# EasyEDA Pro project 轮腿PCB.eprj, schematic Schematic2

## Sheets
1 核心板: Board Name: 主板; Create Date: 2026-02-27
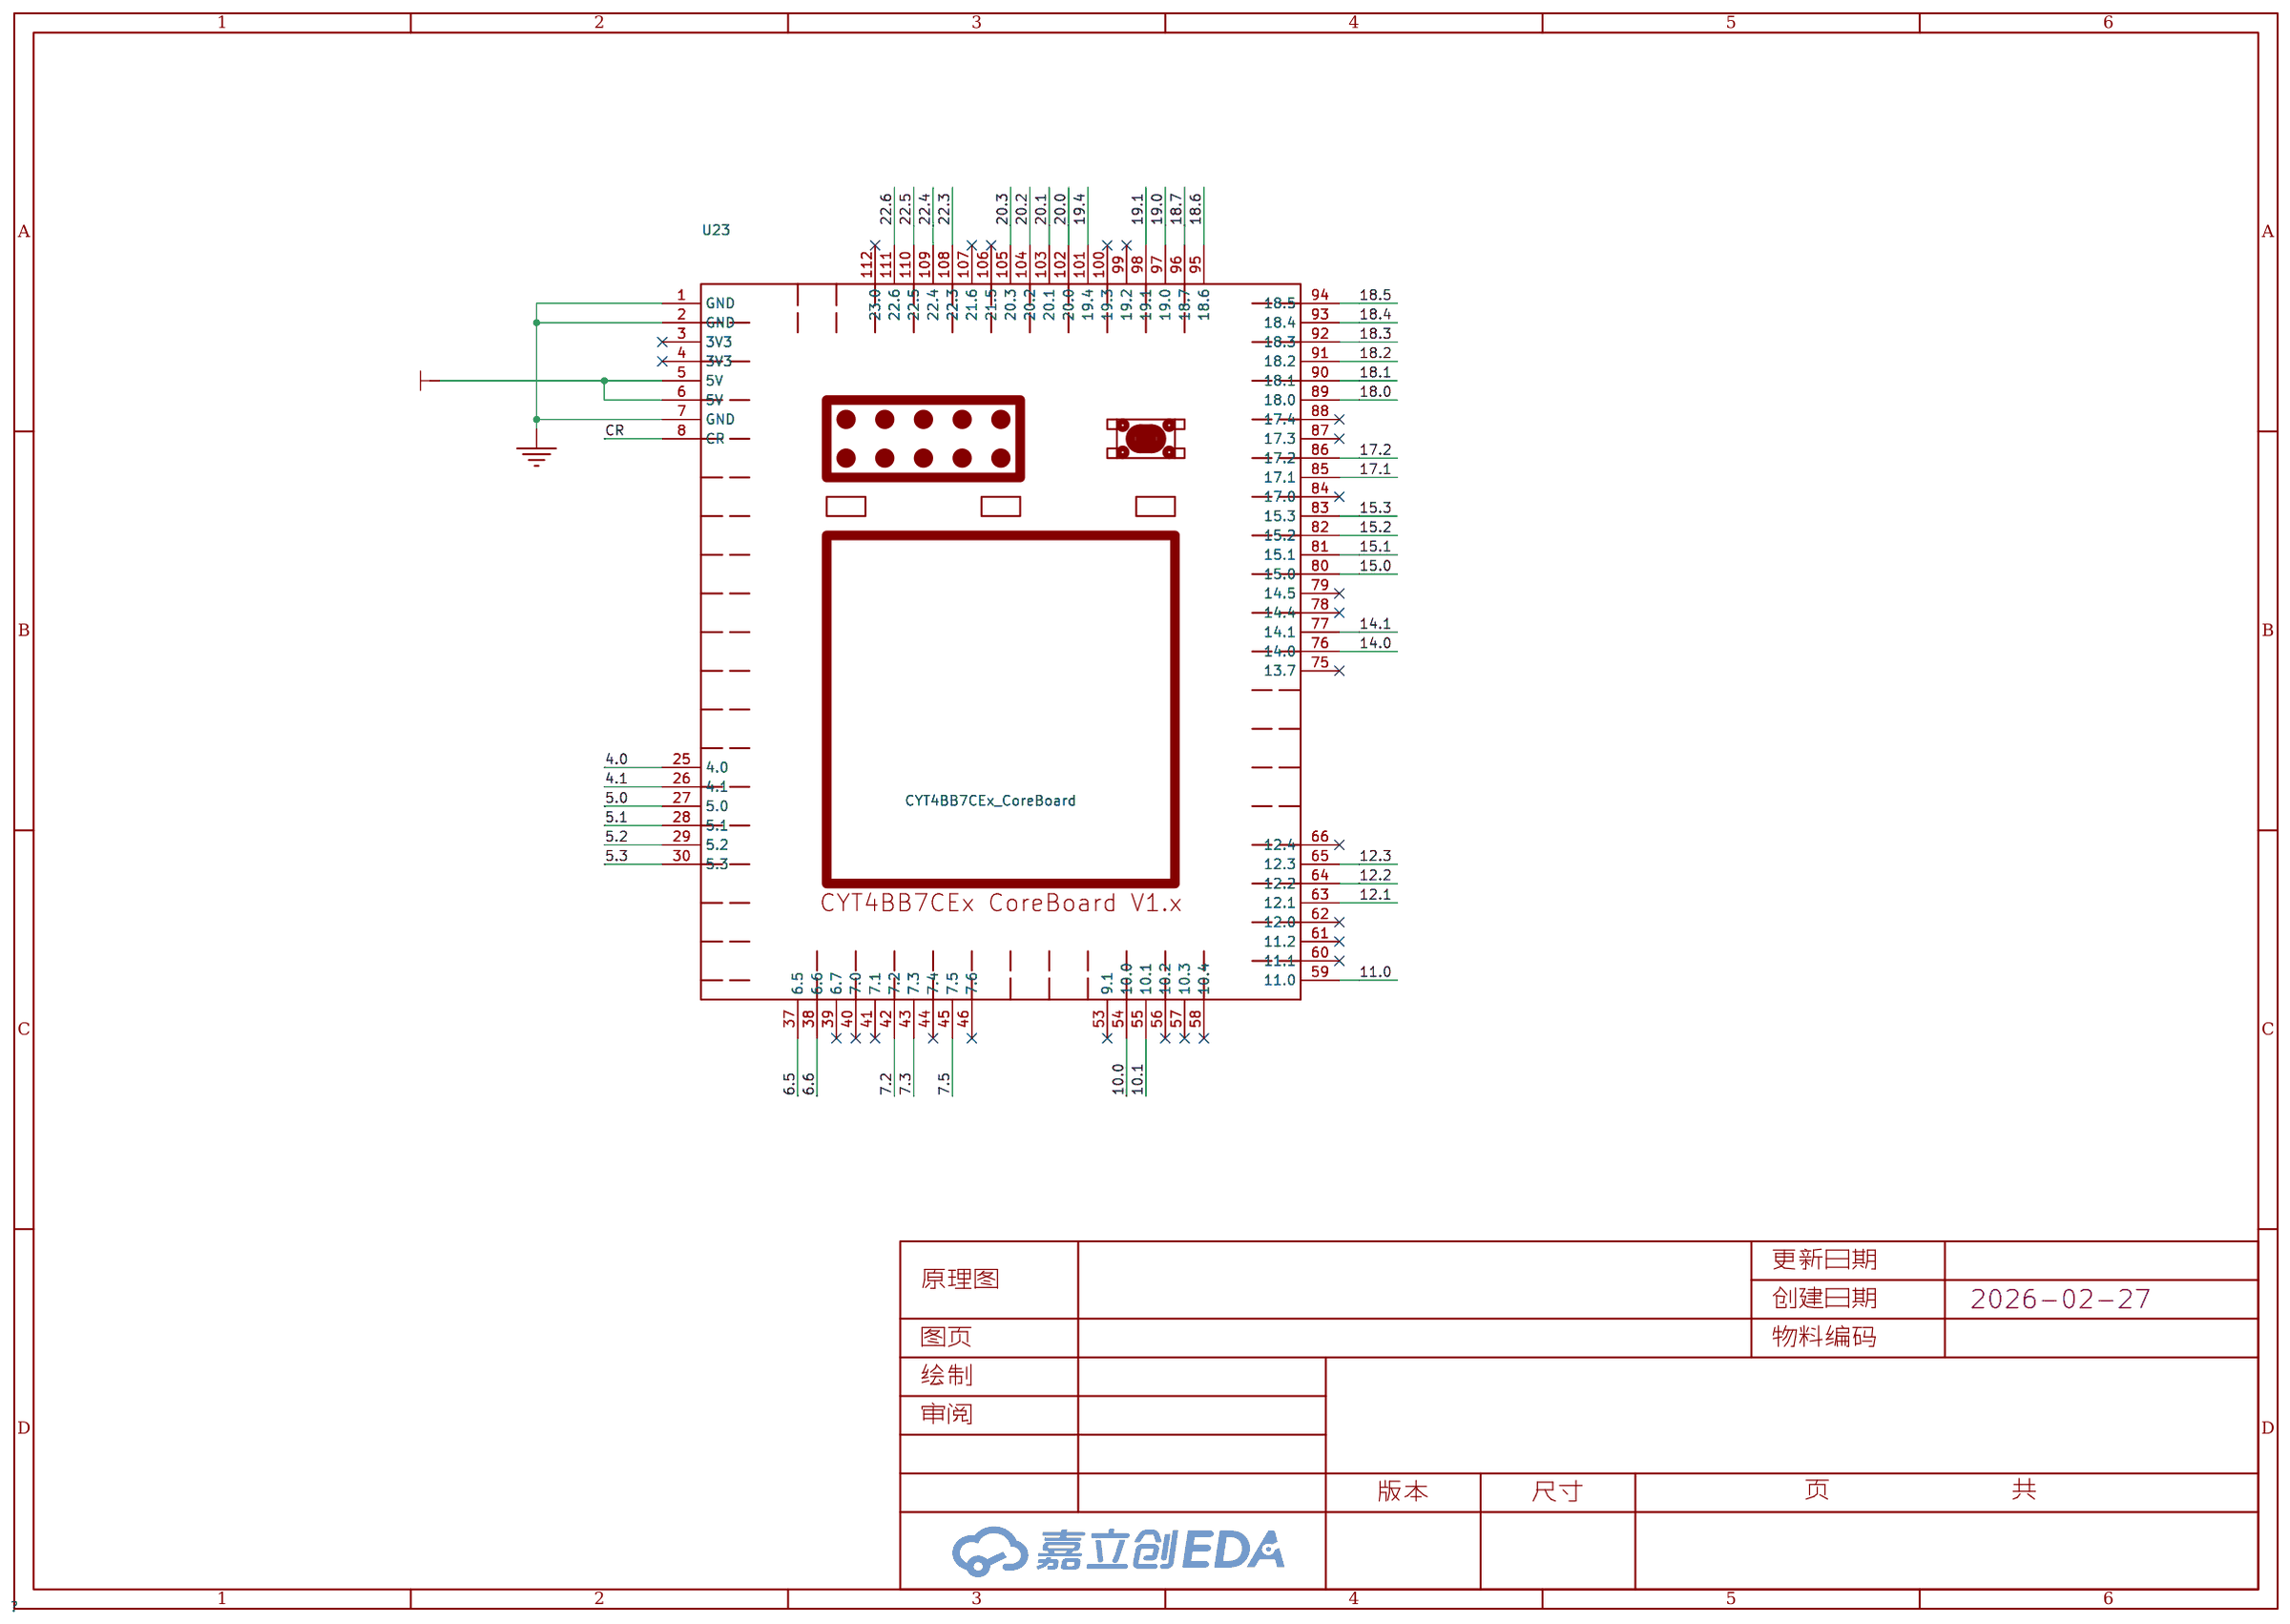
[diagram p1: 核心板]
2 主板: Create Date: 2026-02-28
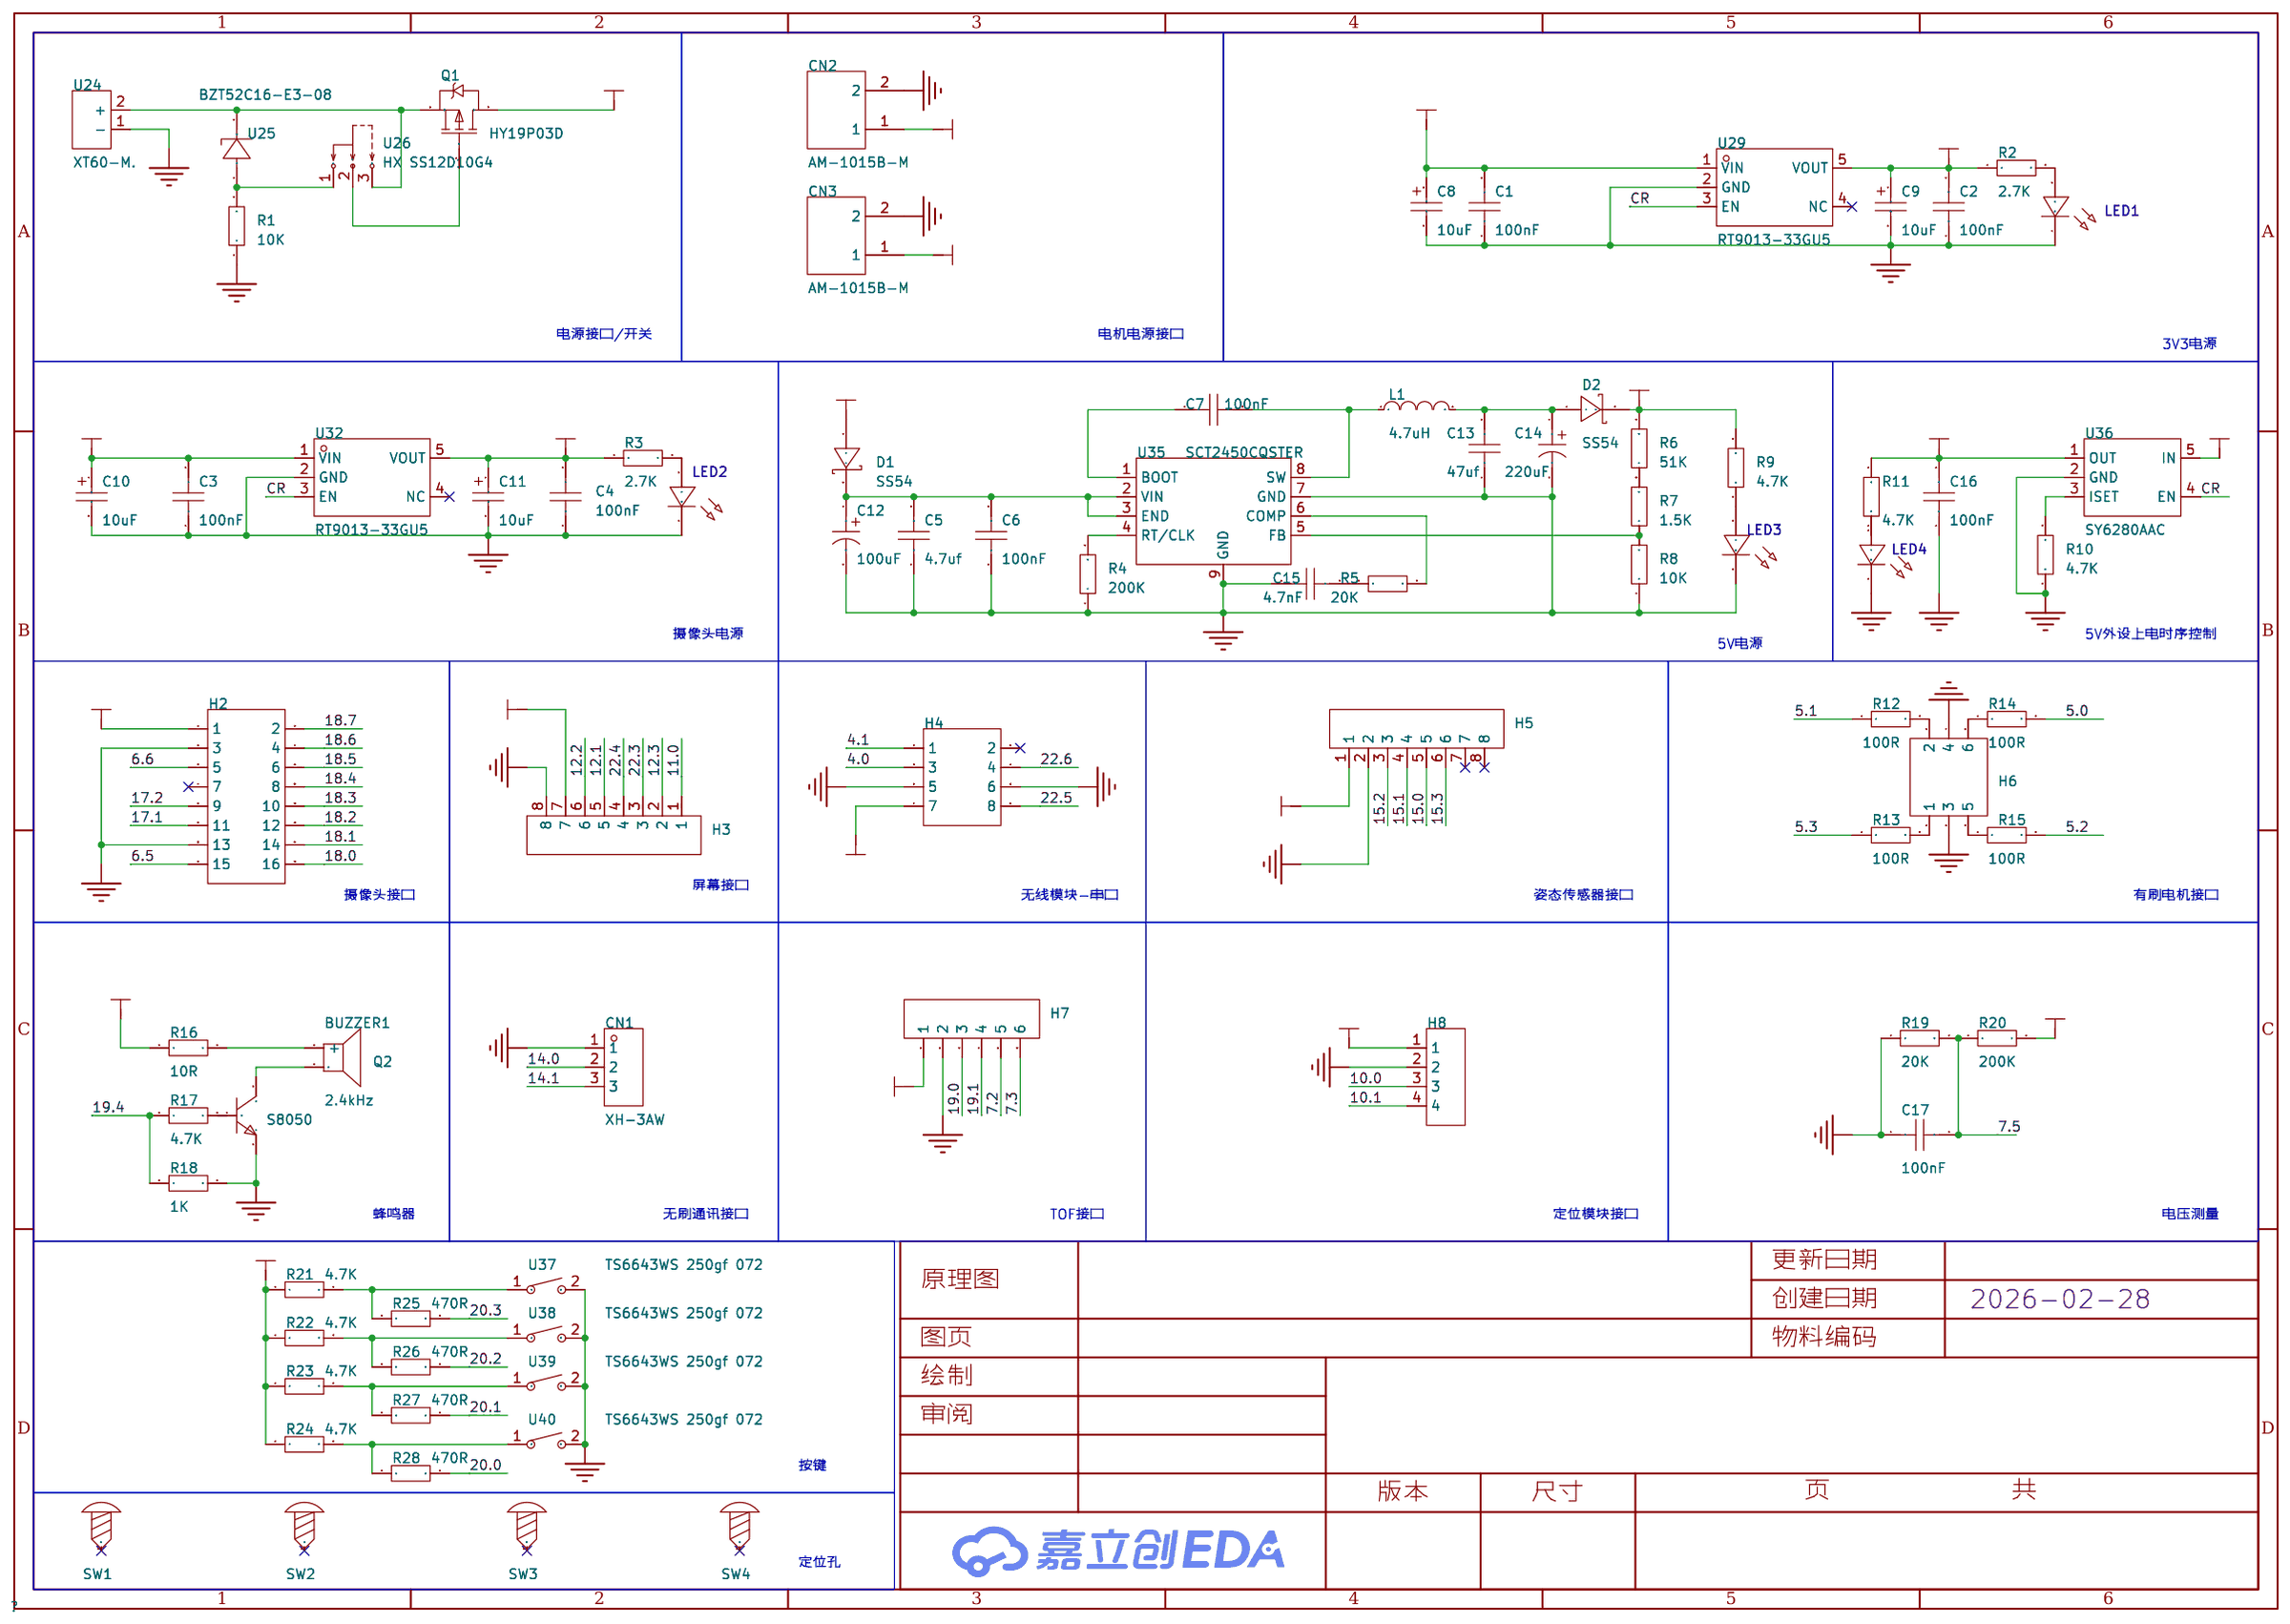
[diagram p2: 主板]

## Parts
sheet 主板
BUZZER1  2.4kHz  [BUZ-TH_BD12.0-P7.60-D0.6-FD]
C1  100nF  [C0603]
C2  100nF  [C0603]
C3  100nF  [C0603]
C4  100nF  [C0603]
C5  4.7uf  [C0603]
C6  100nF  [C0603]
C7  100nF  [C0603]
C8  10uF  [CAP-SMD_L3.2-W1.6-RD-C7171]
C9  10uF  [CAP-SMD_L3.2-W1.6-RD-C7171]
C10  10uF  [CAP-SMD_L3.2-W1.6-RD-C7171]
C11  10uF  [CAP-SMD_L3.2-W1.6-RD-C7171]
C12  100uF  [CAP-SMD_BD6.3-L6.6-W6.6-LS7.3-FD-H7.7]
C13  47uf  [C0603]
C14  220uF  [CAP-SMD_BD8.0-L8.3-W8.3-LS9.1-FD]
C15  4.7nF  [C0603]
C16  100nF  [C0603]
C17  100nF  [C0603]
CN1  XH-3AW  [CONN-TH_3P-P2.54_HCTL_XH-3AW]
CN2  AM-1015B-M  [CONN-TH_AM-1015B-M]
CN3  AM-1015B-M  [CONN-TH_AM-1015B-M]
D1  SS54  [SMA_L4.4-W2.8-LS5.4-R-RD]
D2  SS54  [SMA_L4.4-W2.8-LS5.4-R-RD]
H2  -  [HDR-TH_16P-P2.54-V-F-R2-C8-S2.54-1]
H3  -  [HDR-TH_8P-P2.54-V-F-1]
H4  -  [HDR-TH_8P-P2.54-V-F-R2-C4-S2.54-1]
H5  -  [HDR-TH_8P-P2.54-V-F-1]
H6  -  [HDR-TH_6P-P2.54-V-R2-C3-S2.54_A2541WV-2X3P]
H7  -  [HDR-TH_6P-P2.54-V-M-1]
H8  -  [HDR-TH_4P-P2.54-V-M]
L1  4.7uH  [IND-SMD_L5.4-W5.2_FXL0530]
LED1  -  [LED_0603]
LED2  -  [LED_0603]
LED3  -  [LED_0603]
LED4  -  [LED_0603]
Q1  HY19P03D  [TO-252-2_L6.6-W6.1-P4.57-LS9.9-TL-CW]
Q2  S8050  [SOT-23-3_L2.9-W1.3-P1.90-LS2.3-BR]
R1  10K  [R0603]
R2  2.7K  [R0603]
R3  2.7K  [R0603]
R4  200K  [R0603]
R5  20K  [R0603]
R6  51K  [R0603]
R7  1.5K  [R0603]
R8  10K  [R0603]
R9  4.7K  [R0603]
R10  4.7K  [R0603]
R11  4.7K  [R0603]
R12  100R  [R0603]
R13  100R  [R0603]
R14  100R  [R0603]
R15  100R  [R0603]
R16  10R  [R0603]
R17  4.7K  [R0603]
R18  1K  [R0603]
R19  20K  [R0603]
R20  200K  [R0603]
R21  4.7K  [R0603]
R22  4.7K  [R0603]
R23  4.7K  [R0603]
R24  4.7K  [R0603]
R25  470R  [R0603]
R26  470R  [R0603]
R27  470R  [R0603]
R28  470R  [R0603]
SW1  -  [M3螺丝]
SW2  -  [M3螺丝]
SW3  -  [M3螺丝]
SW4  -  [M3螺丝]
U24  XT60-M.  [CONN-TH_XT60]
U25  BZT52C16-E3-08  [SOD-123_L2.7-W1.6-LS3.7-R-RD]
U26  HX SS12D10G4  [SW-TH_SHOU-HAN_SS12D10G4]
U29  RT9013-33GU5  [SC-70-5_L2.0-W1.3-P0.65-LS2.1-BR]
U32  RT9013-33GU5  [SC-70-5_L2.0-W1.3-P0.65-LS2.1-BR]
U35  SCT2450CQSTER  [ESOP-8_L4.9-W3.9-P1.27-LS6.0-BL-EP]
U36  SY6280AAC  [SOT-23-5_L3.0-W1.7-P0.95-LS2.8-BL]
U37  TS6643WS 250gf 072  [SW-SMD_L6.0-W6.0-P6.00-LS6.8]
U38  TS6643WS 250gf 072  [SW-SMD_L6.0-W6.0-P6.00-LS6.8]
U39  TS6643WS 250gf 072  [SW-SMD_L6.0-W6.0-P6.00-LS6.8]
U40  TS6643WS 250gf 072  [SW-SMD_L6.0-W6.0-P6.00-LS6.8]
sheet 核心板
U23  CYT4BB7CEx_CoreBoard  [CYT4BB7CEx_CoreBoard_V1.x]

## Library data of the parts
BUZZER1 = TMB12A05_C96093: 驱动方式:有源(内含驱动线路);构造类型:电磁式;额定电压:5V;频率:2.4kHz;声压(SPL):85dB;; LCSC Part Name: 有源(内含驱动线路) 电磁式 2.4kHz; Supplier Part: C96093; Manufacturer: 华能; Manufacturer Part: TMB12A05; Supplier Footprint: 插件,D=12mm; Datasheet: https://item.szlcsc.com/datasheet/TMB12A05/97297.html; Supplier: LCSC; Driver Circuitry: 有源(内含驱动线路); Technology: 电磁式; Voltage Rating: 5V; Voltage - Supply: 4V~8V; Current Consumption: 30mA; Sound Pressure Level(SPL): 85dB; Diameter(φD): 12mm; Height: 9.8mm; Operating Temperature: -40℃~+85℃
C1-C6 C13 C15-C17 = CAP_0603: Supplier Footprint: 0603
C7 = CC0603KRX7R9BB104: 容值:100nF;精度:±10%;额定电压:50V;温度系数:X7R;; LCSC Part Name: 100nF ±10% 50V; Supplier Part: C14663; Manufacturer: YAGEO(国巨); Supplier Footprint: 0603; JLCPCB Part Class: 基础库; Datasheet: https://item.szlcsc.com/datasheet/CC0603KRX7R9BB104/15331.html; Supplier: LCSC; Tolerance: ±10%; Voltage Rating: 50V; Temperature Coefficient: X7R
C8-C11 = TAJA106K016RNJ: 容值:10uF;精度:±10%;额定电压:16V;等效串联电阻(ESR):3Ω@100kHz;; LCSC Part Name: 10uF ±10% 16V; Supplier Part: C7171; Manufacturer: Kyocera AVX; Supplier Footprint: CASE-A-3216-18(mm); JLCPCB Part Class: 基础库; Supplier: LCSC; Tolerance: ±10%; Voltage Rating: 16V; Equivalent Series Resistance(ESR): 3Ω@100kHz; Operating Temperature: -55℃~+125℃
C12 = JVJ50V100M6x8: 容值:100uF;精度:±20%;额定电压:50V;纹波电流:140mA@120Hz;; LCSC Part Name: 100uF ±20% 50V; Supplier Part: C46550415; Manufacturer: JIERR(捷而瑞); Supplier Footprint: SMD,D6.3xL7.7mm; Datasheet: https://item.szlcsc.com/datasheet/JVJ50V100M6x8/48680109.html; Supplier: LCSC; Tolerance: ±20%; Voltage Rating: 50V; Ripple Current: 140mA@120Hz; Diameter: 6.3mm; Height - Seated (Max): 7.7mm; Lifetime: 2000hrs@105℃; Operating Temperature: -55℃~+105℃
C14 = FZ220UF25V90RV0110: 容值:220uF;精度:±20%;额定电压:25V;纹波电流:450mA@120Hz;等效串联电阻(ESR):-;; LCSC Part Name: 220uF ±20% 25V; Supplier Part: C3445243; Manufacturer: KNSCHA(科尼盛); Supplier Footprint: SMD,D8xL10.5mm; JLCPCB Part Class: 扩展库; Datasheet: https://atta.szlcsc.com/upload/public/pdf/source/20220701/78AFCE2BE87FD7464372866BD7211356.pdf; Supplier: LCSC; Tolerance: ±20%; Voltage Rating: 25V; Ripple Current: 450mA@120Hz; Diameter: 8mm; Height - Seated (Max): 10.5mm; Lifetime: 5000hrs@105℃; Operating Temperature: -55℃~+105℃
CN1 = XH-3AW_C2908612: 插针结构:1x3P;间距:2.54mm;安装方式:弯插;参考系列:XH;总PIN数:3P;排数:1;每排PIN数:3;行距:-;额定电流:3A;触头材质:黄铜;触头镀层:锡;工作温度:-25℃~+85℃;; LCSC Part Name: 1x3P 间距:2.54mm 弯插 系列:XH; Supplier Part: C2908612; Manufacturer: HCTL(华灿天禄); Supplier Footprint: 弯插,P=2.5mm; Datasheet: https://item.szlcsc.com/datasheet/XH-3AW/3184383.html; Supplier: LCSC; Pins Structure: 1x3P; Pitch: 2.54mm; Mounting Type: 弯插; Reference Series: XH; Number of Pins: 3P; Number of Rows: 1; Number of PINs Per Row: 3; Current Rating: 3A; Contact Material: 黄铜; Contact Plating: 锡; Operating Temperature: -25℃~+85℃; Voltage Rating: 250V; Plastic Material: PA66; Flame Retardant Rating: UL94V-0; Z-Height of the Board: 5.9mm; Y-Width of Bottom Edge on Board: 7mm
CN2 CN3 = AM-1015B-M: 金属材质：铜镀金  绝缘材质：PA; LCSC Part Name: AMASS(艾迈斯)电源连接器公头AM-1015B-M; Supplier Part: C90631; Manufacturer: AMASS(艾迈斯); JLCPCB Part Class: 扩展库; Datasheet: https://item.szlcsc.com/datasheet/AM-1015B-M/91818.html; Supplier: LCSC
D1 D2 = SS54_C22452: 二极管配置:独立式;正向压降(Vf):550mV@5A;直流反向耐压(Vr):40V;整流电流:5A;; LCSC Part Name: 电压:40V 电流:5A; Supplier Part: C22452; Manufacturer: MDD(辰达半导体); Supplier Footprint: SMA(DO-214AC); JLCPCB Part Class: 基础库; Datasheet: https://item.szlcsc.com/datasheet/SS54/23178.html; Supplier: LCSC; Diode Configuration: 独立式; Voltage - Forward(Vf@If): 550mV@5A; Voltage - DC Reverse(Vr): 40V; Current - Rectified: 5A; Reverse Leakage Current (Ir): 1mA@40V; Operating Junction Temperature Range: -55℃~+125℃
H2 = HDR-F_2.54_2x8: Supplier Part: C30734; Supplier Footprint: 插件
H3 H5 = HDR-F_2.54_1x8P: Supplier Part: C27438; Supplier Footprint: 插件
H4 = HDR-F_2.54_2x4: Supplier Part: C92271; Supplier Footprint: 插件
H6 = HDR-M_2.54_2x3: Supplier Part: C402781; Supplier Footprint: 插件,P=2.54mm
H7 = HDR-M_2.54_1x6P: Supplier Part: C37208; Supplier Footprint: 插件
H8 = HDR-M_2.54_1x4P: Supplier Part: C492403; Supplier Footprint: 插件
L1 = FXL0530-4R7-M: 电感值:4.7uH;精度:±20%;额定电流:4.5A;饱和电流(Isat):5A;类型:一体成型电感;; LCSC Part Name: 4.7uH ±20% 5A; Supplier Part: C177246; Manufacturer: cjiang(长江微电); Supplier Footprint: SMD,5.4x5.2mm; Datasheet: https://item.szlcsc.com/datasheet/FXL0530-4R7-M/188638.html; Supplier: LCSC; Tolerance: ±20%; Current Rating: 4.5A; Current - Saturation(Isat): 5A; DC Resistance(DCR): 60mΩ; Type: 一体成型电感
LED1-LED4 = LED_0603-B: Supplier Footprint: 0603
Q1 = HY19P03D: 类型:P沟道;漏源电压(Vdss):30V;连续漏极电流(Id):90A;功率(Pd):50W;导通电阻(RDS(on)@Vgs,Id):6mΩ@10V,45A;阈值电压(Vgs(th)@Id):3V@250uA;; LCSC Part Name: P沟道 耐压:30V 电流:90A; Supplier Part: C122492; Manufacturer: HUAYI(华羿微); Supplier Footprint: TO-252-2; JLCPCB Part Class: 扩展库; Datasheet: https://atta.szlcsc.com/upload/public/pdf/source/20170728/C122492_1501225751911848809.pdf; Supplier: LCSC; Type: P沟道; Drain Source Voltage (Vdss): 30V; Continuous Drain Current (Id): 90A; Power Dissipation (Pd): 50W; Drain Source On Resistance (RDS(on)@Vgs,Id): 6mΩ@10V,45A; Gate Threshold Voltage (Vgs(th)@Id): 3V@250uA
Q2 = S8050_C20069125: 晶体管类型:NPN;集电极电流(Ic):500mA;集射极击穿电压(Vceo):25V;耗散功率(Pd):300mW;直流电流增益(hFE):120@50mA,1.0V;; LCSC Part Name: hFE:200-350，丝印:J3Y NPN 500mA 25V; Supplier Part: C20069125; Manufacturer: R+O(宏嘉诚); Supplier Footprint: SOT-23; Datasheet: https://item.szlcsc.com/datasheet/S8050/21397163.html; Supplier: LCSC; type: NPN; Current - Collector(Ic): 500mA; Collector - Emitter Voltage VCEO: 25V; Pd - Power Dissipation: 300mW; DC Current Gain: 120@50mA,1.0V; Transition frequency(fT): 100MHz; Current - Collector Cutoff: 100nA; Vce Saturation(VCE(sat)): 600mV@500mA,50mA; Operating Temperature: -55℃~+150℃; Emitter-Base Voltage(Vebo): 5V
R1-R28 = Res_0603: Supplier Footprint: 0603
SW1-SW4 = M3螺丝: Supplier Footprint: 插件
U24 = XT60-M.: 模型锂电连接器 XT60-M; LCSC Part Name: AMASS(艾迈斯) XT60模型插头 3.5mm镀金香蕉头公头（电调端）XT60-M; Supplier Part: C98733; Manufacturer: AMASS(艾迈斯); Datasheet: https://item.szlcsc.com/datasheet/XT60-M./99943.html; Supplier: LCSC
U25 = BZT52C16-E3-08: 二极管配置:独立式;稳压值(标称值):16V;稳压值(范围):15.3V~16.8V;耗散功率(Pd):300mW;; LCSC Part Name: 独立式 耐压:16V 电流:100nA@12V; Supplier Part: C3736909; Manufacturer: VISHAY(威世); Supplier Footprint: SOD-123; Datasheet: https://item.szlcsc.com/datasheet/BZT52C16-E3-08/4304434.html; Supplier: LCSC; Diode Configuration: 独立式; Zener Voltage(Nom): 16V; Reverse Leakage Current (Ir): 100nA@12V; Zener Voltage(Range): 15.3V~16.8V; Pd - Power Dissipation: 300mW; Impedance(Zzt): 40Ω; Impedance(Zzk): 170Ω; Operating Junction Temperature Range: -55℃~+150℃
U26 = HX SS12D10G4: 电路结构:单刀双掷;安装方式:直插;开关颜色:黑色;额定电流:2A;额定电压:125V;工作寿命:1万次;; LCSC Part Name: 拨动开关 立式两档拨动,单排3脚插件,12.7x6.7x6.4,黑柄4mm; Supplier Part: C5149841; Manufacturer: hanxia(韩下); Supplier Footprint: 插件,12.7x6.7mm; Datasheet: https://item.szlcsc.com/datasheet/HX%2520SS12D10G4/5774355.html; Supplier: LCSC; Circuit: 单刀双掷; Actuator Style: 矩形柱状; Termination Style: PC引脚; Length: 12.7mm; Width: 6.7mm; Switch Height: 10.6mm; Mounting Type: 直插; Actuator Color: 黑色; Current Rating: 2A; Voltage Rating: 125V; Life: 1万次; Operating Temperature: -25℃~+70℃
U29 U32 = RT9013-33GU5: 输出类型:固定;工作电压:5.5V;输出电压:3.3V;输出电流:500mA;电源纹波抑制比(PSRR):50dB@(10kHz);输出极性:正极;; LCSC Part Name: 500mA、低压差、低噪声、无旁路电容的超快速CMOS LDO稳压器; Supplier Part: C3034127; Manufacturer: RICHTEK(立锜); Supplier Footprint: SC-70-5; JLCPCB Part Class: 扩展库; Datasheet: https://item.szlcsc.com/datasheet/RT9013-33GU5/3577904.html; Supplier: LCSC; Output Type: 固定; Voltage - Supply: 5.5V; Output Voltage: 3.3V; Output Current: 500mA; Power Supply Rejection Ratio (PSRR): 50dB@(10kHz); Voltage Dropout: 400mV@(500mA); standby current: 50uA; Noise: 30uVrms; Features: 过流保护；带使能；过热保护; Operating Temperature: -40℃~+85℃; Output Configuration: 正极; Number of Outputs: 1
U35 = SCT2450CQSTER: Supplier Part: C48971626; Supplier Footprint: ESOP-8; JLCPCB Part Class: 扩展库; Supplier: LCSC
U36 = SY6280AAC_C55136: 类型:高侧开关;通道数:1;输入控制逻辑:高电平有效;工作电压:2.4V~5.5V;导通电阻:80mΩ;; LCSC Part Name: 低损耗功率分配开关; Supplier Part: C55136; Manufacturer: Silergy(矽力杰); Supplier Footprint: SOT-23-5; Datasheet: https://item.szlcsc.com/datasheet/SY6280AAC/56162.html; Supplier: LCSC; Type: 高侧开关; Number of Channels: 1; Control Input Logic: 高电平有效; Voltage - Supply: 2.4V~5.5V; RDS(on): 80mΩ; Operating Temperature	-: -40℃~+125℃; Features: 过热保护(OTP)；过流保护(OCP)
U37-U40 = TS6643WS 250gf 072: 电路结构:单刀单掷;按钮形状:圆形按钮;作用力:2.5N;安装方式:立贴;开关长度:6mm;开关宽度:6mm;开关高度:4.3mm;带支架:不带;触点电流:50mA;额定电压(DC):12V;绝缘电阻:100MΩ;带灯:无;机械寿命:10万次;; LCSC Part Name: 6*6*4.3mm 立贴 轻触开关 无声软胶; Supplier Part: C6364686; Manufacturer: SHOU HAN(首韩); Supplier Footprint: SMD; Datasheet: https://atta.szlcsc.com/upload/public/pdf/source/20230523/7B21E479361B05F0C7B61E17A73CF12C.pdf; Supplier: LCSC; Circuit: 单刀单掷; Actuator Style: 圆形按钮; Operating Force: 2.5N; Mounting Style: 立贴; Switch Length: 6mm; Switch Width: 6mm; Switch Height: 4.3mm; Strike Gundam: 不带; Contact Current: 50mA; Voltage Rating (DC): 12V; Insulation Resistance: 100MΩ; Actuator/Cap Color: 黑色; With Lamp: 无; Mechanical Life: 10万次; Operating Temperature: -20℃~+70℃
U23 = CYT4BB7CEx_CoreBoard

## Nets
GND: C1.1 C2.1 C3.1 C4.1 C5.1 C6.1 C8.2 C9.2 C10.2 C11.2 C12.2 C13.1 C14.2 C15.1 C16.1 C17.1 CN1.1 CN2.2 CN3.2 H2.3 H2.13 H3.8 H4.5 H4.6 H5.2 H6.3 H6.4 H7.2 H8.2 LED1.1(C) LED2.1(C) LED3.1(C) LED4.1(C) Q2.2(E) R1.1 R4.1 R8.1 R10.1 R18.2 R19.1 U23.1(GND) U23.2(GND) U23.7(GND) U24.1(-) U29.2(GND) U32.2(GND) U35.7(GND) U35.9(GND) U36.2(GND) U37.2 U38.2 U39.2 U40.2
VCC3V3: C2.2 C9.1 H3.7 H5.1 R2.1 R16.1 R21.1 R22.1 R23.1 R24.1 U29.5(VOUT)
VCC5V: C1.2 C3.2 C8.1 C10.1 D2.2(K) R6.2 R9.2 U23.5(5V) U23.6(5V) U29.1(VIN) U32.1(VIN) U36.5(IN)
VCC5V_EXT: C16.2 H4.7 H7.1 H8.1 R11.2 U36.1(OUT)
VCCBAT: CN2.1 CN3.1 D1.1(A) Q1.2(D) R20.2
VCCCAM: C4.2 C11.1 H2.1 R3.1 U32.5(VOUT)
4.0: H4.3 U23.25(4.0)
4.1: H4.1 U23.26(4.1)
5.0: R14.2 U23.27(5.0)
5.1: R12.1 U23.28(5.1)
5.2: R15.2 U23.29(5.2)
5.3: R13.1 U23.30(5.3)
6.5: H2.15 U23.37(6.5)
6.6: H2.5 U23.38(6.6)
7.2: H7.5 U23.42(7.2)
7.3: H7.6 U23.43(7.3)
7.5: C17.2 R19.2 R20.1 U23.45(7.5)
10.0: H8.3 U23.54(10.0)
10.1: H8.4 U23.55(10.1)
11.0: H3.1 U23.59(11.0)
12.1: H3.5 U23.63(12.1)
12.2: H3.6 U23.64(12.2)
12.3: H3.2 U23.65(12.3)
14.0: CN1.2 U23.76(14.0)
14.1: CN1.3 U23.77(14.1)
15.0: H5.5 U23.80(15.0)
15.1: H5.4 U23.81(15.1)
15.2: H5.3 U23.82(15.2)
15.3: H5.6 U23.83(15.3)
17.1: H2.11 U23.85(17.1)
17.2: H2.9 U23.86(17.2)
18.0: H2.16 U23.89(18.0)
18.1: H2.14 U23.90(18.1)
18.2: H2.12 U23.91(18.2)
18.3: H2.10 U23.92(18.3)
18.4: H2.8 U23.93(18.4)
18.5: H2.6 U23.94(18.5)
18.6: H2.4 U23.95(18.6)
18.7: H2.2 U23.96(18.7)
19.0: H7.3 U23.97(19.0)
19.1: H7.4 U23.98(19.1)
19.4: R17.1 R18.1 U23.101(19.4)
20.0: R28.2 U23.102(20.0)
20.1: R27.2 U23.103(20.1)
20.2: R26.2 U23.104(20.2)
20.3: R25.2 U23.105(20.3)
22.3: H3.3 U23.108(22.3)
22.4: H3.4 U23.109(22.4)
22.5: H4.8 U23.110(22.5)
22.6: H4.4 U23.111(22.6)
CR: U23.8(CR) U29.3(EN) U32.3(EN) U36.4(EN)
$2N234: R1.2 U25.1(A) U26.1
$2N293: Q1.3(S) U24.2(+) U25.2(C) U26.3
$2N569: Q1.1(G) U26.2
$2N1583: LED1.2(A) R2.2
$2N1949: LED2.2(A) R3.2
$2N2132: C5.2 C6.2 C12.1 D1.2(K) U35.2(VIN) U35.3(END)
$2N2387: R4.2 U35.4(RT/CLK)
$2N2461: C7.1 U35.1(BOOT)
$2N2539: C7.2 L1.1 U35.8(SW)
$2N3928: C13.2 C14.1 D2.1(A) L1.2
$2N4209: C15.2 R5.1
$2N4213: R5.2 U35.6(COMP)
$2N4321: R6.1 R7.2
$2N4347: R7.1 R8.2 U35.5(FB)
$2N4596: LED3.2(A) R9.1
$2N4969: R10.2 U36.3(ISET)
$2N5187: LED4.2(A) R11.1
$2N7606: H6.2 R12.2
$2N7608: H6.1 R13.2
$2N7610: H6.5 R15.1
$2N7612: H6.6 R14.1
$2N7802: BUZZER1.1(+) R16.2
$2N7975: Q2.1(B) R17.2
$2N8022: BUZZER1.2 Q2.3(C)
$2N9225: R21.2 R25.1 U37.1
$2N9229: R22.2 R26.1 U38.1
$2N9234: R23.2 R27.1 U39.1
$2N9239: R24.2 R28.1 U40.1

Not connected (* = marked no-connect by the designer): H2 7*; H4 2*; H5 7* 8*; SW1 1*; SW2 1*; SW3 1*; SW4 1*; U23 3(3V3)* 4(3V3)* 39(6.7)* 40(7.0)* 41(7.1)* 44(7.4)* 46(7.6)* 53(9.1)* 56(10.2)* 57(10.3)* 58(10.4)* 60(11.1)* 61(11.2)* 62(12.0)* 66(12.4)* 75(13.7)* 78(14.4)* 79(14.5)* 84(17.0)* 87(17.3)* 88(17.4)* 99(19.2)* 100(19.3)* 106(21.5)* 107(21.6)* 112(23.0)*; U29 4(NC)*; U32 4(NC)*

## Notes on the sheets
sheet 2
- 电源接口/开关
- 电机电源接口
- 3V3电源
- 摄像头电源
- 5V电源
- 5V外设上电时序控制
- 摄像头接口
- 屏幕接口
- 无线模块-串口
- 姿态传感器接口
- 有刷电机接口
- 蜂鸣器
- 无刷通讯接口
- TOF接口
- 定位模块接口
- 电压测量
- 按键
- 定位孔
